# EAGLE schematic RTDS (EAGLE 9.6.2)
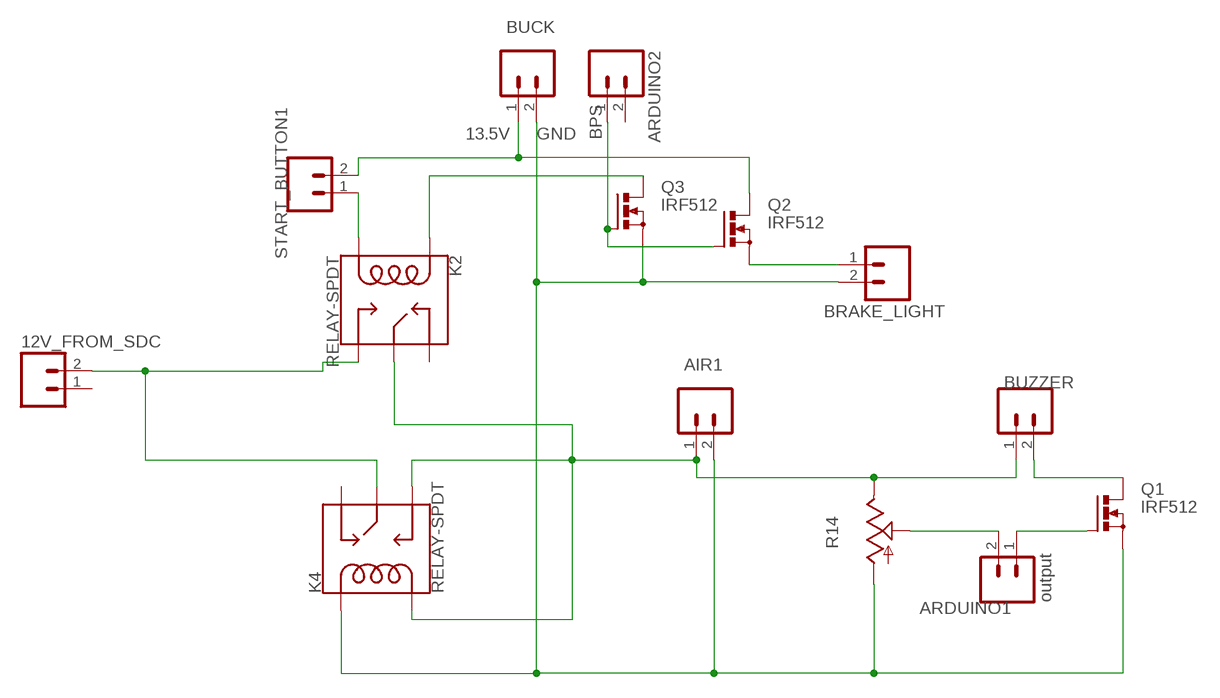
[diagram p0: schematic, sheet 1]

## Parts
12V_FROM_SDC  M02  [02P]
AIR1  M02  [02P]
ARDUINO1  output  M02  [02P]
ARDUINO2  BPS  M02  [02P]
BRAKE_LIGHT  M02  [02P]
BUCK  M02  [02P]
BUZZER  M02  [02P]
K2  RELAY-SPDT  [RELAY_G5LE]
K4  RELAY-SPDT  [RELAY_G5LE]
Q1  IRF512  [TO220BV]
Q2  IRF512  [TO220BV]
Q3  IRF512  [TO220BV]
R14  TRIM_US-B25P  [B25P]
START_BUTTON1  M02  [02P]

## Nets
13.5V: BUCK.1 Q2.D START_BUTTON1.2
GND: AIR1.2 BRAKE_LIGHT.2 BUCK.2 K4.2(COIL1) Q1.S Q3.S R14.A
N$1: K2.5(COIL2) START_BUTTON1.1
N$2: BRAKE_LIGHT.1 Q2.S
N$3: 12V_FROM_SDC.2 K2.3(NO) K4.1(MAIN)
N$7: ARDUINO1.2 R14.S
N$8: BUZZER.2 Q1.D
N$9: AIR1.1 BUZZER.1 K2.1(MAIN) K4.3(NO) K4.5(COIL2) R14.E
N$11: ARDUINO2.1 Q2.G Q3.G
N$12: K2.2(COIL1) Q3.D
N$13: ARDUINO1.1 Q1.G
Unconnected: 12V_FROM_SDC.1 ARDUINO2.2 K2.4(NC) K4.4(NC)

## Library data of the parts
12V_FROM_SDC AIR1 ARDUINO1 ARDUINO2 BRAKE_LIGHT BUCK BUZZER START_BUTTON1 = con-amp-quick:M02: AMP QUICK CONNECTOR; OC_FARNELL: unknown; OC_NEWARK: unknown
K2 K4 = SparkFun-Electromechanical:RELAY-SPDT: SPDT Electromechanical Relay Single-pole, double-throw sealed relays. When current is applied to the coil, it throws a simple changeover switch, terminating the connection from the NC contact to ground and closing the NO contact. Use them to switch high voltage/high current devices. SparkFun Products JQX-15F: Relay SPDT Sealed - 20A <https://www.sparkfun.com/products/10924> (COM-10924) JZC-11F: Relay SPDT Sealed <https://www.sparkfun.com/products/100> (COM-00100); PROD_ID: COMP-14214
Q1-Q3 = transistor-power:IRF512: N-CHANNEL MOS FET
R14 = pot:TRIM_US-: POTENTIOMETER